# Altium schematic sheet Top Level.SchDoc
size A3
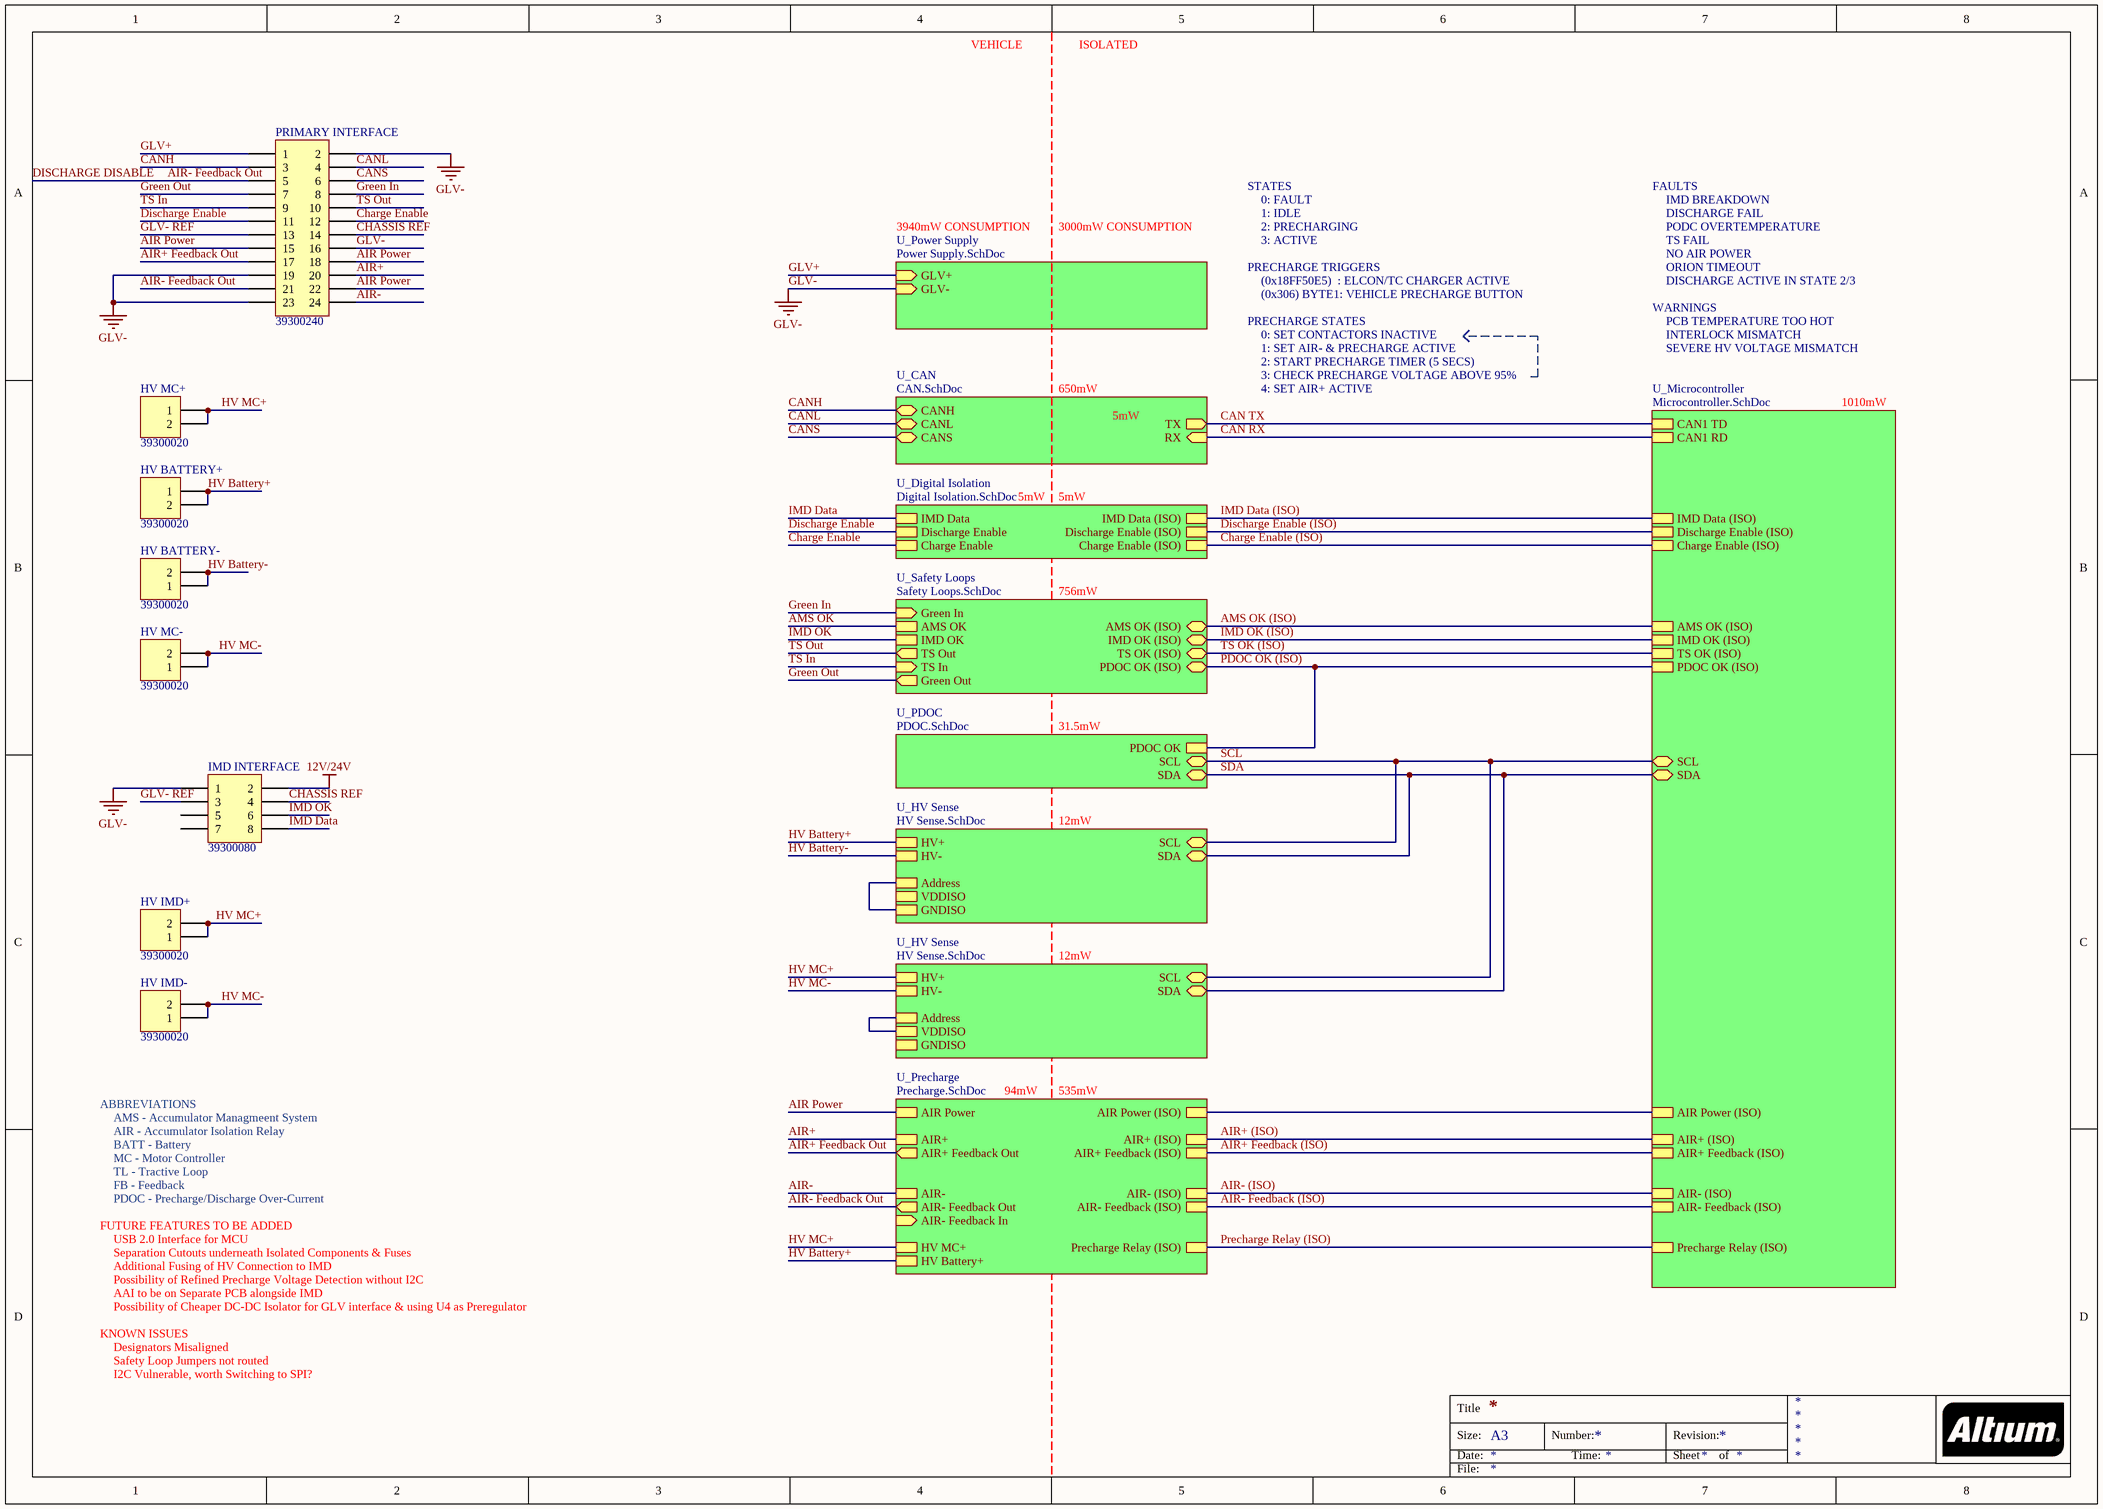
[diagram p0: Top Level.SchDoc]

## Parts
HV_BATTERY+  39300020  [39300020]
HV_BATTERY-  39300020  [39300020]
HV_IMD+  39300020  [39300020]
HV_IMD-  39300020  [39300020]
HV_MC+  39300020  [39300020]
HV_MC-  39300020  [39300020]
IMD_INTERFACE  39300080  [39300080]
PRIMARY_INTERFACE  39300240  [39300240]

## Sub-sheets
U_CAN = CAN.SchDoc: CANH (bidir), CANL (bidir), CANS (bidir), RX (in), TX (out)
U_Digital Isolation = Digital Isolation.SchDoc: IMD Data, Discharge Enable, Charge Enable, IMD Data (ISO), Discharge Enable (ISO), Charge Enable (ISO)
U_HV Sense = HV Sense.SchDoc: HV+, HV-, SCL (bidir), SDA (bidir), Address, VDDISO, GNDISO
U_HV Sense = HV Sense.SchDoc: HV+, HV-, SCL (bidir), SDA (bidir), Address, VDDISO, GNDISO
U_Microcontroller = Microcontroller.SchDoc: AIR- Feedback (ISO), AIR+ Feedback (ISO), AIR- (ISO), Precharge Relay (ISO), AIR+ (ISO), CAN1 TD, IMD OK (ISO), PDOC OK (ISO), AMS OK (ISO), TS OK (ISO), CAN1 RD, IMD Data (ISO), Discharge Enable (ISO), Charge Enable (ISO), SCL (bidir), SDA (bidir), AIR Power (ISO)
U_PDOC = PDOC.SchDoc: PDOC OK, SCL (bidir), SDA (bidir)
U_Power Supply = Power Supply.SchDoc: GLV+ (in), GLV- (in)
U_Precharge = Precharge.SchDoc: AIR Power, AIR- (ISO), AIR- Feedback Out (out), AIR- Feedback (ISO), AIR-, AIR- Feedback In (in), AIR+, AIR+ Feedback Out (out), AIR+ (ISO), AIR+ Feedback (ISO), Precharge Relay (ISO), HV MC+, HV Battery+, AIR Power (ISO)
U_Safety Loops = Safety Loops.SchDoc: AMS OK, IMD OK (ISO) (bidir), AMS OK (ISO) (bidir), PDOC OK (ISO) (bidir), TS OK (ISO) (bidir), Green In (in), IMD OK, TS Out (out), TS In (in), Green Out (out)

## Nets
12V/24V: IMD_INTERFACE.2
GLV-: IMD_INTERFACE.1 PRIMARY_INTERFACE.2 PRIMARY_INTERFACE.16 PRIMARY_INTERFACE.19 PRIMARY_INTERFACE.23 ; sheet U_Power Supply/GLV-
AIR Power: PRIMARY_INTERFACE.15 PRIMARY_INTERFACE.18 PRIMARY_INTERFACE.22 ; sheet U_Precharge/AIR Power
AIR+: PRIMARY_INTERFACE.20 ; sheet U_Precharge/AIR+
AIR+ (ISO): sheet U_Precharge/AIR+ (ISO), sheet U_Microcontroller/AIR+ (ISO)
AIR+ Feedback (ISO): sheet U_Precharge/AIR+ Feedback (ISO), sheet U_Microcontroller/AIR+ Feedback (ISO)
AIR+ Feedback Out: PRIMARY_INTERFACE.17 ; sheet U_Precharge/AIR+ Feedback Out
AIR-: PRIMARY_INTERFACE.24 ; sheet U_Precharge/AIR-
AIR- (ISO): sheet U_Precharge/AIR- (ISO), sheet U_Microcontroller/AIR- (ISO)
AIR- Feedback (ISO): sheet U_Precharge/AIR- Feedback (ISO), sheet U_Microcontroller/AIR- Feedback (ISO)
AIR- Feedback Out: PRIMARY_INTERFACE.5 PRIMARY_INTERFACE.21 ; sheet U_Precharge/AIR- Feedback Out  [also labelled DISCHARGE DISABLE]
AMS OK: sheet U_Safety Loops/AMS OK
AMS OK (ISO): sheet U_Safety Loops/AMS OK (ISO), sheet U_Microcontroller/AMS OK (ISO)
CAN RX: sheet U_CAN/RX, sheet U_Microcontroller/CAN1 RD
CAN TX: sheet U_CAN/TX, sheet U_Microcontroller/CAN1 TD
CANH: PRIMARY_INTERFACE.3 ; sheet U_CAN/CANH
CANL: PRIMARY_INTERFACE.4 ; sheet U_CAN/CANL
CANS: PRIMARY_INTERFACE.6 ; sheet U_CAN/CANS
Charge Enable: PRIMARY_INTERFACE.12 ; sheet U_Digital Isolation/Charge Enable
Charge Enable (ISO): sheet U_Digital Isolation/Charge Enable (ISO), sheet U_Microcontroller/Charge Enable (ISO)
CHASSIS REF: IMD_INTERFACE.4 PRIMARY_INTERFACE.14
Discharge Enable: PRIMARY_INTERFACE.11 ; sheet U_Digital Isolation/Discharge Enable
Discharge Enable (ISO): sheet U_Digital Isolation/Discharge Enable (ISO), sheet U_Microcontroller/Discharge Enable (ISO)
GLV+: PRIMARY_INTERFACE.1 ; sheet U_Power Supply/GLV+
GLV- REF: IMD_INTERFACE.3 PRIMARY_INTERFACE.13
Green In: PRIMARY_INTERFACE.8 ; sheet U_Safety Loops/Green In
Green Out: PRIMARY_INTERFACE.7 ; sheet U_Safety Loops/Green Out
HV Battery+: HV_BATTERY+.1 HV_BATTERY+.2 ; sheet U_HV Sense/HV+, sheet U_Precharge/HV Battery+
HV Battery-: HV_BATTERY-.1 HV_BATTERY-.2 ; sheet U_HV Sense/HV-
HV MC+: HV_IMD+.1 HV_IMD+.2 HV_MC+.1 HV_MC+.2 ; sheet U_HV Sense/HV+, sheet U_Precharge/HV MC+
HV MC-: HV_IMD-.1 HV_IMD-.2 HV_MC-.1 HV_MC-.2 ; sheet U_HV Sense/HV-
IMD Data: IMD_INTERFACE.8 ; sheet U_Digital Isolation/IMD Data
IMD Data (ISO): sheet U_Digital Isolation/IMD Data (ISO), sheet U_Microcontroller/IMD Data (ISO)
IMD OK: IMD_INTERFACE.6 ; sheet U_Safety Loops/IMD OK
IMD OK (ISO): sheet U_Safety Loops/IMD OK (ISO), sheet U_Microcontroller/IMD OK (ISO)
PDOC OK (ISO): sheet U_Safety Loops/PDOC OK (ISO), sheet U_PDOC/PDOC OK, sheet U_Microcontroller/PDOC OK (ISO)
Precharge Relay (ISO): sheet U_Precharge/Precharge Relay (ISO), sheet U_Microcontroller/Precharge Relay (ISO)
SCL: sheet U_HV Sense/SCL, sheet U_HV Sense/SCL, sheet U_PDOC/SCL, sheet U_Microcontroller/SCL
SDA: sheet U_HV Sense/SDA, sheet U_HV Sense/SDA, sheet U_PDOC/SDA, sheet U_Microcontroller/SDA
TS In: PRIMARY_INTERFACE.9 ; sheet U_Safety Loops/TS In
TS OK (ISO): sheet U_Safety Loops/TS OK (ISO), sheet U_Microcontroller/TS OK (ISO)
TS Out: PRIMARY_INTERFACE.10 ; sheet U_Safety Loops/TS Out
(unnamed): sheet U_HV Sense/Address, sheet U_HV Sense/GNDISO
(unnamed): sheet U_HV Sense/Address, sheet U_HV Sense/VDDISO
(unnamed): sheet U_Precharge/AIR Power (ISO), sheet U_Microcontroller/AIR Power (ISO)

Not connected (* = marked no-connect by the designer): IMD_INTERFACE 5 7

## Notes on the sheet
- VEHICLE
- ISOLATED
- 3940mW CONSUMPTION
- 3000mW CONSUMPTION
- STATES
- 0: FAULT
- 1: IDLE
- 2: PRECHARGING
- 3: ACTIVE
- FAULTS
- IMD BREAKDOWN
- DISCHARGE FAIL
- PODC OVERTEMPERATURE
- TS FAIL
- PRECHARGE TRIGGERS
- (0x18FF50E5)  : ELCON/TC CHARGER ACTIVE
- (0x306) BYTE1: VEHICLE PRECHARGE BUTTON
- WARNINGS
- NO AIR POWER
- ORION TIMEOUT
- DISCHARGE ACTIVE IN STATE 2/3
- PRECHARGE STATES
- 1: SET AIR- & PRECHARGE ACTIVE
- 2: START PRECHARGE TIMER (5 SECS)
- 3: CHECK PRECHARGE VOLTAGE ABOVE 95%
- 0: SET CONTACTORS INACTIVE
- PCB TEMPERATURE TOO HOT
- INTERLOCK MISMATCH
- SEVERE HV VOLTAGE MISMATCH
- 650mW
- 5mW
- 4: SET AIR+ ACTIVE
- 1010mW
- 756mW
- 31.5mW
- 12mW
- ABBREVIATIONS
- AMS - Accumulator Managmeent System
- 94mW
- 535mW
- TL - Tractive Loop
- FB - Feedback
- BATT - Battery
- MC - Motor Controller
- AIR - Accumulator Isolation Relay
- FUTURE FEATURES TO BE ADDED
- PDOC - Precharge/Discharge Over-Current
- USB 2.0 Interface for MCU
- Separation Cutouts underneath Isolated Components & Fuses
- Additional Fusing of HV Connection to IMD
- Possibility of Refined Precharge Voltage Detection without I2C
- AAI to be on Separate PCB alongside IMD
- Possibility of Cheaper DC-DC Isolator for GLV interface & using U4 as Preregulator
- KNOWN ISSUES
- Designators Misaligned
- Safety Loop Jumpers not routed
- I2C Vulnerable, worth Switching to SPI?
- Title
- Size:
- Date:
- A3
- Number:
- Time:
- Revision:
- Sheet
- of
- File:

## Library data of the parts
HV_BATTERY+ HV_BATTERY- HV_IMD+ HV_IMD- HV_MC+ HV_MC- = 39300020: Positions: 2; Pitch: 4.2mm; Row Spacing: 5.5mm; Angle: 90; Flange: No; Contact: Tin; Part Number: 39300020; Digikey Part Number: WM21351-ND
IMD_INTERFACE = 39300080: Positions: 8; Pitch: 4.2mm; Row Spacing: 5.5mm; Angle: 90; Flange: No; Contact: Tin; Part Number: 39300080; Digikey Part Number: WM21354-ND
PRIMARY_INTERFACE = 39300240: Positions: 24; Pitch: 4.2mm; Row Spacing: 5.5mm; Angle: 90; Flange: No; Contact: Tin; Part Number: 39300240; Digikey Part Number: WM21362-ND